# Altium schematic sheet Sheet1.SchDoc
size A4
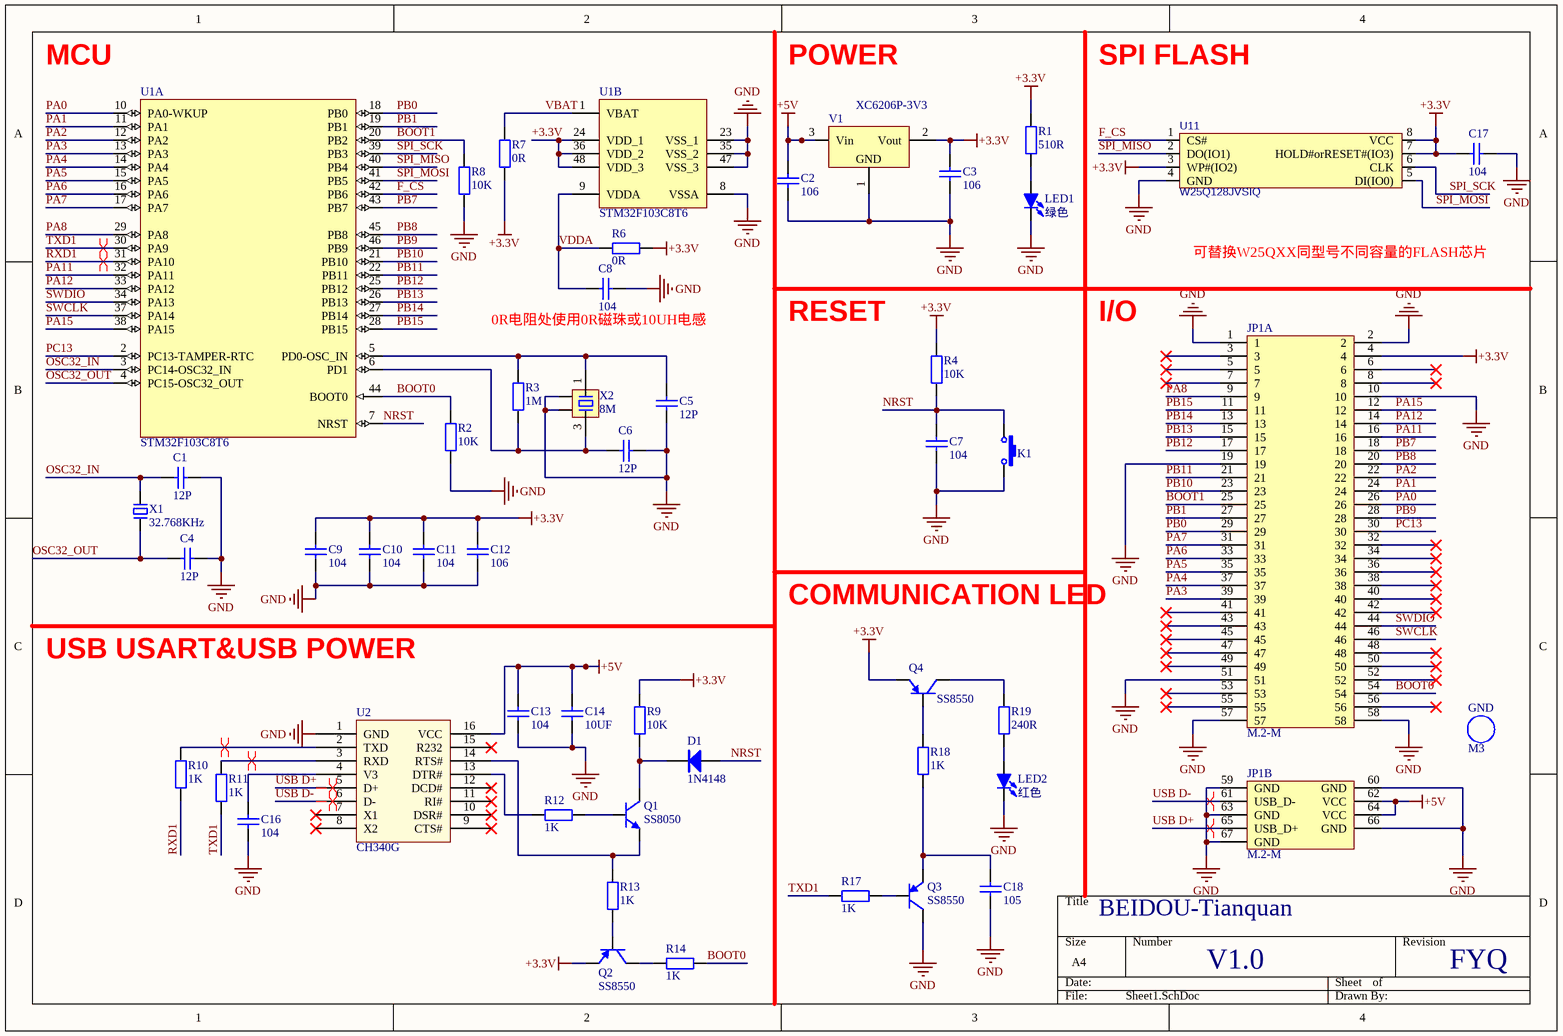
[diagram p0: Sheet1.SchDoc]

## Parts
C1  12P  [C0603_L]
C2  106  [C0603_L]
C3  106  [C0603_L]
C4  12P  [C0603_L]
C5  12P  [C0603_L]
C6  12P  [C0603_L]
C7  104  [C0603_L]
C8  104  [C0603_L]
C9  104  [C0603_L]
C10  104  [C0603_L]
C11  104  [C0603_L]
C12  106  [C0603_L]
C13  104  [C0603_L]
C14  10UF  [C0603_L]
C16  104  [C0603_L]
C17  104  [C0603_L]
C18  105  [C0603_L]
D1  1N4148  [SOD-323]
GND  M3  [M3 125X200]
JP1  M.2-M  [M.2-MKEY]  (parts A,B of 2)
K1  3x6x5  [SW SMD-3*4*2.5]  (value not drawn)
LED1  绿色  [LED0603_G]
LED2  红色  [LED0603_G]
Q1  SS8050  [SOT23-3L]
Q2  SS8550  [SOT23-3L]
Q3  SS8550  [SOT23-3N]
Q4  SS8550  [SOT23-3N]
R1  510R  [R0603_L]
R2  10K  [R0603_L]
R3  1M  [R0603_L]
R4  10K  [R0603_L]
R6  0R  [R0603_L]
R7  0R  [R0603_L]
R8  10K  [R0603_L]
R9  10K  [R0603_L]
R10  1K  [R0603_L]
R11  1K  [R0603_L]
R12  1K  [R0603_L]
R13  1K  [R0603_L]
R14  1K  [R0603_L]
R17  1K  [R0603_L]
R18  1K  [R0603_L]
R19  240R  [R0603_L]
U1  STM32F103C8T6  [LQFP48_N]  (parts A,B of 2)
U2  CH340G  [SOP16_N]
U11  W25Q128JVSIQ  [SOIC-8W]
V1  XC6206P-3V3  [SOT23-3N]
X1  32.768KHz  [OSC 3215-2P]
X2  8M  [OSC 3225-4P]

## Nets
+3.3V: C3.2 C9.2 C10.2 C11.2 C12.2 C17.2 JP1.4 Q2.2(E) Q4.2(E) R1.1 R4.1 R6.1 R7.1 R9.1 U1.24(VDD_1) U1.36(VDD_2) U1.48(VDD_3) U11.3(WP#(IO2)) U11.7(HOLD#orRESET#(IO3)) U11.8(VCC) V1.2(Vout)
+5V: C2.2 C13.2 C14.2 JP1.62(VCC) JP1.64(VCC) U2.16(VCC) V1.3(Vin)
GND: C1.2 C2.1 C3.1 C4.2 C5.1 C6.2 C7.1 C8.2 C9.1 C10.1 C11.1 C12.1 C13.1 C14.1 C16.1 C17.1 C18.1 JP1.1 JP1.2 JP1.10 JP1.19 JP1.51 JP1.57 JP1.58 JP1.59(GND) JP1.60(GND) JP1.63(GND) JP1.66(GND) JP1.67(GND) K1.2 LED1.2(K) LED2.2(K) Q3.3(C) R2.1 R8.1 U1.8(VSSA) U1.23(VSS_1) U1.35(VSS_2) U1.47(VSS_3) U2.1(GND) U11.4(GND) V1.1(GND) X2.2 X2.4
BOOT0: JP1.54 R2.2 R14.2 U1.44(BOOT0)
BOOT1: JP1.25 R8.2 U1.20(PB2)
F_CS: U1.42(PB6) U11.1(CS#)
NRST: C7.2 D1.1(A) K1.1 R4.2 U1.7(NRST)
OSC32_IN: C1.1 U1.3(PC14-OSC32_IN) X1.2
OSC32_OUT: C4.1 U1.4(PC15-OSC32_OUT) X1.1
PA0: JP1.26 U1.10(PA0-WKUP)
PA1: JP1.24 U1.11(PA1)
PA2: JP1.22 U1.12(PA2)
PA3: JP1.39 U1.13(PA3)
PA4: JP1.37 U1.14(PA4)
PA5: JP1.35 U1.15(PA5)
PA6: JP1.33 U1.16(PA6)
PA7: JP1.31 U1.17(PA7)
PA8: JP1.9 U1.29(PA8)
PA11: JP1.16 U1.32(PA11)
PA12: JP1.14 U1.33(PA12)
PA15: JP1.12 U1.38(PA15)
PB0: JP1.29 U1.18(PB0)
PB1: JP1.27 U1.19(PB1)
PB7: JP1.18 U1.43(PB7)
PB8: JP1.20 U1.45(PB8)
PB9: JP1.28 U1.46(PB9)
PB10: JP1.23 U1.21(PB10)
PB11: JP1.21 U1.22(PB11)
PB12: JP1.17 U1.25(PB12)
PB13: JP1.15 U1.26(PB13)
PB14: JP1.13 U1.27(PB14)
PB15: JP1.11 U1.28(PB15)
PC13: JP1.30 U1.2(PC13-TAMPER-RTC)
RXD1: R10.2 U1.31(PA10)
SPI_MISO: U1.40(PB4) U11.2(DO(IO1))
SPI_MOSI: U1.41(PB5) U11.5(DI(IO0))
SPI_SCK: U1.39(PB3) U11.6(CLK)
SWCLK: JP1.46 U1.37(PA14)
SWDIO: JP1.44 U1.34(PA13)
TXD1: R11.2 R17.1 U1.30(PA9)
USB D+: JP1.65(USB_D+) U2.5(D+)
USB D-: JP1.61(USB_D-) U2.6(D-)
VBAT: R7.2 U1.1(VBAT)
VDDA: C8.1 R6.2 U1.9(VDDA)
NetC5_2: C5.2 R3.1 U1.5(PD0-OSC_IN) X2.1
NetC6_1: C6.1 R3.2 U1.6(PD1) X2.3
NetC16_2: C16.2 U2.4(V3)
NetC18_2: C18.2 Q3.2(E) R18.1
NetD1_2: D1.2(K) Q1.3(C) R9.2
NetLED1_1: LED1.1(A) R1.2
NetLED2_1: LED2.1(A) R19.1
NetQ1_1: Q1.1(B) R12.2
NetQ1_2: Q1.2(E) R13.1 U2.14(RTS#)
NetQ2_1: Q2.1(B) R13.2
NetQ2_3: Q2.3(C) R14.1
NetQ3_1: Q3.1(B) R17.2
NetQ4_1: Q4.1(B) R18.2
NetQ4_3: Q4.3(C) R19.2
NetR10_1: R10.1 U2.2(TXD)
NetR11_1: R11.1 U2.3(RXD)
NetR12_1: R12.1 U2.13(DTR#)

Not connected (* = marked no-connect by the designer): JP1 3* 5* 6* 7* 8* 32* 34* 36* 38* 40* 41* 42* 43* 45* 47* 48* 49* 50* 52* 53* 55* 56*; U2 7(X1)* 8(X2)* 9(CTS#)* 10(DSR#)* 11(RI#)* 12(DCD#)* 15(R232)*

## Layout directives
differential pair: NetR10_1, NetR11_1, RXD1, TXD1, USB D+, USB D-

## Notes on the sheet
- MCU
- POWER
- SPI FLASH
- 可替换W25QXX同型号不同容量的FLASH芯片
- (near C8) 0R电阻处使用0R磁珠或10UH电感
- RESET
- I/O
- COMMUNICATION LED
- USB USART&USB POWER
- BEIDOU-Tianquan
- V1.0
- FYQ

## Library data of the parts
C1-C14 C16-C18 = C: 贴片电容; BOM名称: 无极性贴片电容; 联系卖家，免费查找封装: 唯一出售店铺网址https://shop463601444.taobao.com; 封装库来自淘宝卖家ID：黄晶宝石: 其他店铺购入均为盗版假冒封装库，请立即申请退款
D1 = 1N4148: 开关二极管; BOM名称: 高速开关二极管; 联系卖家，免费查找封装: 唯一出售店铺网址https://shop463601444.taobao.com
GND = M3: 铜柱孔; 联系卖家，免费查找封装: 唯一出售店铺网址https://shop463601444.taobao.com; BOM名称: 铜柱孔
JP1 = M.2-M接口
K1 = SW-PB: 微动开关; BOM名称: 3x6轻触开关; 联系卖家，免费查找封装: 唯一出售店铺网址https://shop463601444.taobao.com
LED1 LED2 = LED-SMD: 贴片LED; 封装库来自淘宝卖家 ID：黄晶宝石: 其他店铺购入均为假冒，请立即申请退款，本店奖励现金5~20元; BOM名称: 贴片LED
Q1 = 8050-SMD: 高频放大-NPN型; 联系卖家，免费查找封装: 唯一出售店铺网址https://shop463601444.taobao.com; 封装库来自淘宝卖家 ID：黄晶宝石: 其他店铺购入均为盗版，不享受售后技术支持服务，请立即申请退款; 参数: 40V 1.5A 1W 100MHZ; BOM名称: 高频放大-NPN型
Q2-Q4 = 8550-SMD: 高频放大-PNP型; 联系卖家，免费查找封装: 唯一出售店铺网址https://shop463601444.taobao.com; 封装库来自淘宝卖家 ID：黄晶宝石: 其他店铺购入均为盗版，不享受售后技术支持服务，请立即申请退款; 参数: 40V 1.5A 1W 100MHZ; BOM名称: 高频放大-PNP型
R1-R4 R6-R14 R17-R19 = R: 贴片电阻; 联系卖家，免费查找封装: 唯一出售店铺网址https://shop463601444.taobao.com; 封装库来自淘宝卖家ID：黄晶宝石: 其他店铺购入均为盗版假冒封装库，请立即申请退款; BOM名称: 贴片电阻
U1 = STM32F103C8T6: STM32 ARM-based 32-bit MCU Performance Line with 64 kB Flash, 20 kB Internal RAM, -40 to +85癈 Temperature, 48-Pin LQFP, Tray; 联系卖家，免费查找封装: 唯一出售店铺网址https://shop463601444.taobao.com; DatasheetVersion: rev13.0, Apr-2011; PackageVersion: rev13, Apr-2011; PackageReference: LQFP48; PackageDescription: 48-Pin Low-Profile Quad Flat Pack, 7 x 7 mm Body, 0.5 mm Pitch (LQFP48); ComponentLink1Description: Manufacturer URL; ComponentLink1URL: http://www.st.com/; ComponentLink2Description: STM32F103 Datasheet; ComponentLink2URL: http://www.st.com/internet/com/TECHNICAL_RESOURCES/TECHNICAL_LITERATURE/DATASHEET/CD00161566.pdf; ComponentLink3Description: STM32 Family Web Page; ComponentLink3URL: www.st.com/stm32
U2 = CH340G: 串口转USB芯片; 联系卖家，免费技术支持: 唯一出售店铺网址https://shop463601444.taobao.com
U11 = W25Q128: SPI FLASH; 封装库来自 淘宝卖家 ID：黄晶宝石: 其他店铺购入均为盗版假冒封装库，请立即申请退款
V1 = XC6206P: 三端稳压芯片; BOM名称: 稳压芯片; 封装库来自淘宝卖家 ID：黄晶宝石: 其他店铺购入均为盗版，请立即申请退款，本店现金奖励5~20元; 联系卖家 免费查找封装: 唯一出售店铺网址https://shop463601444.taobao.com
X1 = XTAL-2P: 2脚无源脚晶振; 联系卖家，免费查找封装: 唯一出售店铺网址https://shop463601444.taobao.com; BOM名称: 2脚无源脚晶振
X2 = XTAL-4P: 4脚无源晶振; 联系卖家，免费查找封装: 唯一出售店铺网址https://shop463601444.taobao.com; BOM名称: 4脚无源晶振